# Altium schematic sheet Sheet1.SchDoc
size A
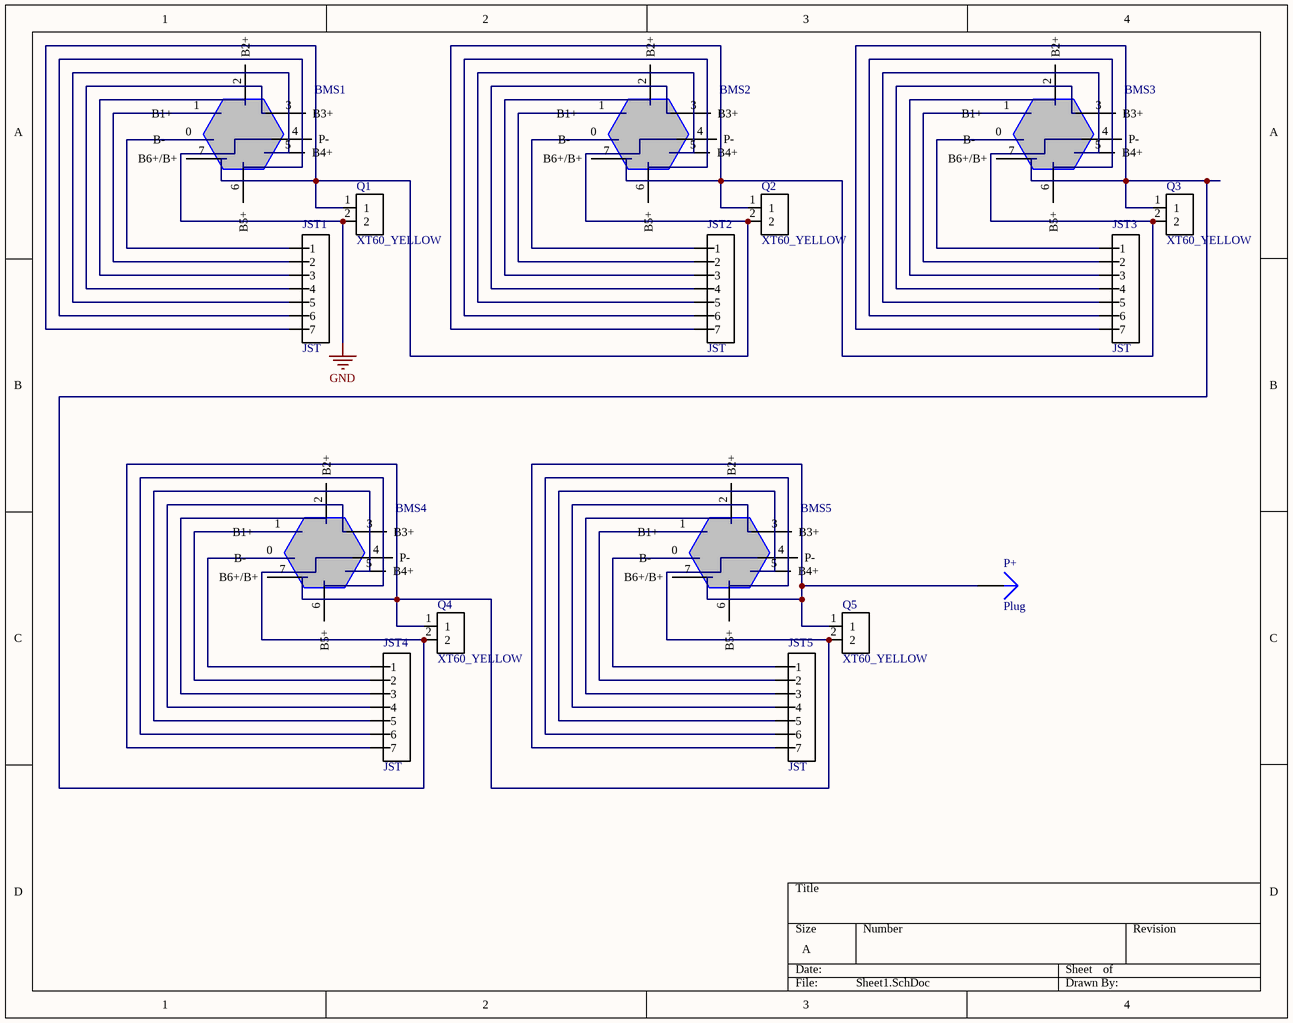
[diagram p0: Sheet1.SchDoc]

## Parts
BMS1  BMS  [BMS]  (value not drawn)
BMS2  BMS  [BMS]  (value not drawn)
BMS3  BMS  [BMS]  (value not drawn)
BMS4  BMS  [BMS]  (value not drawn)
BMS5  BMS  [BMS]  (value not drawn)
JST1  JST  [JST]
JST2  JST  [JST]
JST3  JST  [JST]
JST4  JST  [JST]
JST5  JST  [JST]
P+  Plug  [PIN1]
Q1  XT60_YELLOW  [*AMASS_XT60PB-M]
Q2  XT60_YELLOW  [*AMASS_XT60PB-M]
Q3  XT60_YELLOW  [*AMASS_XT60PB-M]
Q4  XT60_YELLOW  [*AMASS_XT60PB-M]
Q5  XT60_YELLOW  [*AMASS_XT60PB-M]

## Nets
GND: BMS1.4(P-) Q1.2
NetBMS1_0: BMS1.0(B-) JST1.1
NetBMS1_1: BMS1.1(B1+) JST1.2
NetBMS1_2: BMS1.2(B2+) JST1.3
NetBMS1_3: BMS1.3(B3+) JST1.4
NetBMS1_5: BMS1.5(B4+) JST1.5
NetBMS1_6: BMS1.6(B5+) JST1.6
NetBMS1_7: BMS1.7(B6+/B+) BMS2.4(P-) JST1.7 Q1.1 Q2.2
NetBMS2_0: BMS2.0(B-) JST2.1
NetBMS2_1: BMS2.1(B1+) JST2.2
NetBMS2_2: BMS2.2(B2+) JST2.3
NetBMS2_3: BMS2.3(B3+) JST2.4
NetBMS2_5: BMS2.5(B4+) JST2.5
NetBMS2_6: BMS2.6(B5+) JST2.6
NetBMS2_7: BMS2.7(B6+/B+) BMS3.4(P-) JST2.7 Q2.1 Q3.2
NetBMS3_0: BMS3.0(B-) JST3.1
NetBMS3_1: BMS3.1(B1+) JST3.2
NetBMS3_2: BMS3.2(B2+) JST3.3
NetBMS3_3: BMS3.3(B3+) JST3.4
NetBMS3_5: BMS3.5(B4+) JST3.5
NetBMS3_6: BMS3.6(B5+) JST3.6
NetBMS3_7: BMS3.7(B6+/B+) BMS4.4(P-) JST3.7 Q3.1 Q4.2
NetBMS4_0: BMS4.0(B-) JST4.1
NetBMS4_1: BMS4.1(B1+) JST4.2
NetBMS4_2: BMS4.2(B2+) JST4.3
NetBMS4_3: BMS4.3(B3+) JST4.4
NetBMS4_5: BMS4.5(B4+) JST4.5
NetBMS4_6: BMS4.6(B5+) JST4.6
NetBMS4_7: BMS4.7(B6+/B+) BMS5.4(P-) JST4.7 Q4.1 Q5.2
NetBMS5_0: BMS5.0(B-) JST5.1
NetBMS5_1: BMS5.1(B1+) JST5.2
NetBMS5_2: BMS5.2(B2+) JST5.3
NetBMS5_3: BMS5.3(B3+) JST5.4
NetBMS5_5: BMS5.5(B4+) JST5.5
NetBMS5_6: BMS5.6(B5+) JST5.6
NetBMS5_7: BMS5.7(B6+/B+) JST5.7 P+.1 Q5.1

## Library data of the parts
BMS1-BMS5 = BMS: Battery Management System
JST1-JST5 = JST: Connector Header Through Hole, Right Angle 7 position 0.098 _2.50mm_; MF: JST Sales; MP: S7B-XH-A_LF__SN_; SnapEDA_Link: https://www.snapeda.com/parts/S7B-XH-A%28LF%29%28SN%29/JST%20Sales%20America%20Inc./view-part/2768211/?ref=snap; Availability: Unavailable; Price: None; Package: None; Value: *
Q1-Q5 = EC3: Power connector; 65A; PIN: 2; Colour: yellow; MF: Pololu; MP: XT60 YELLOW; SnapEDA_Link: https://www.snapeda.com/parts/XT60%20YELLOW/Pololu/view-part/423230/?ref=snap; Availability: Unavailable; Price: None; Package: None; Value: *
P+ = Plug: LatestRevisionDate: 17-Jul-2002; LatestRevisionNote: Re-released for DXP Platform.; Publisher: Altium Limited